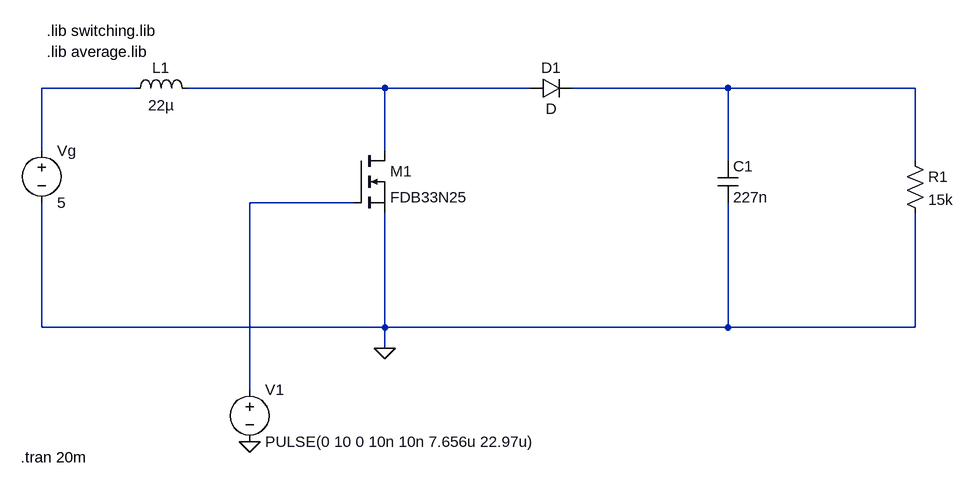
[diagram p0: schematic DCM boost example.asc]
DCM boost example.asc, the LTspice schematic file:
Version 4
SHEET 1 1436 680
WIRE 160 48 16 48
WIRE 544 48 240 48
WIRE 768 48 544 48
WIRE 1072 48 832 48
WIRE 1360 48 1072 48
WIRE 16 144 16 48
WIRE 544 144 544 48
WIRE 1072 160 1072 48
WIRE 1360 160 1360 48
WIRE 496 224 336 224
WIRE 16 416 16 224
WIRE 544 416 544 240
WIRE 544 416 16 416
WIRE 1072 416 1072 224
WIRE 1072 416 544 416
WIRE 1360 416 1360 240
WIRE 1360 416 1072 416
WIRE 544 448 544 416
WIRE 336 512 336 224
FLAG 544 448 0
FLAG 336 592 0
SYMBOL voltage 16 128 R0
WINDOW 123 0 0 Left 0
WINDOW 39 0 0 Left 0
SYMATTR InstName Vg
SYMATTR Value 5
SYMBOL ind 144 64 R270
WINDOW 0 32 56 VTop 2
WINDOW 3 5 56 VBottom 2
SYMATTR InstName L1
SYMATTR Value 22µ
SYMBOL nmos 496 144 R0
SYMATTR InstName M1
SYMATTR Value FDB33N25
SYMBOL diode 768 64 R270
WINDOW 0 32 32 VTop 2
WINDOW 3 0 32 VBottom 2
SYMATTR InstName D1
SYMBOL cap 1056 160 R0
SYMATTR InstName C1
SYMATTR Value 227n
SYMBOL voltage 336 496 R0
WINDOW 123 0 0 Left 0
WINDOW 39 0 0 Left 0
SYMATTR InstName V1
SYMATTR Value PULSE(0 10 0 10n 10n 7.656u 22.97u)
SYMBOL res 1344 144 R0
SYMATTR InstName R1
SYMATTR Value 15k
TEXT -16 616 Left 2 !.tran 20m
TEXT 24 -40 Left 2 !.lib switching.lib
TEXT 24 -8 Left 2 !.lib average.lib

The netlist it stands for:
* DCM boost example.asc
Vg N001 0 5
L1 N001 N002 22µ
M1 N002 N004 0 0 FDB33N25
D1 N002 N003 D
C1 N003 0 227n
V1 N004 0 PULSE(0 10 0 10n 10n 7.656u 22.97u)
R1 N003 0 15k
.model D D
.lib standard.dio
.model NMOS NMOS
.model PMOS PMOS
.lib standard.mos
.tran 20m
.lib switching.lib
.lib average.lib
.backanno
.end